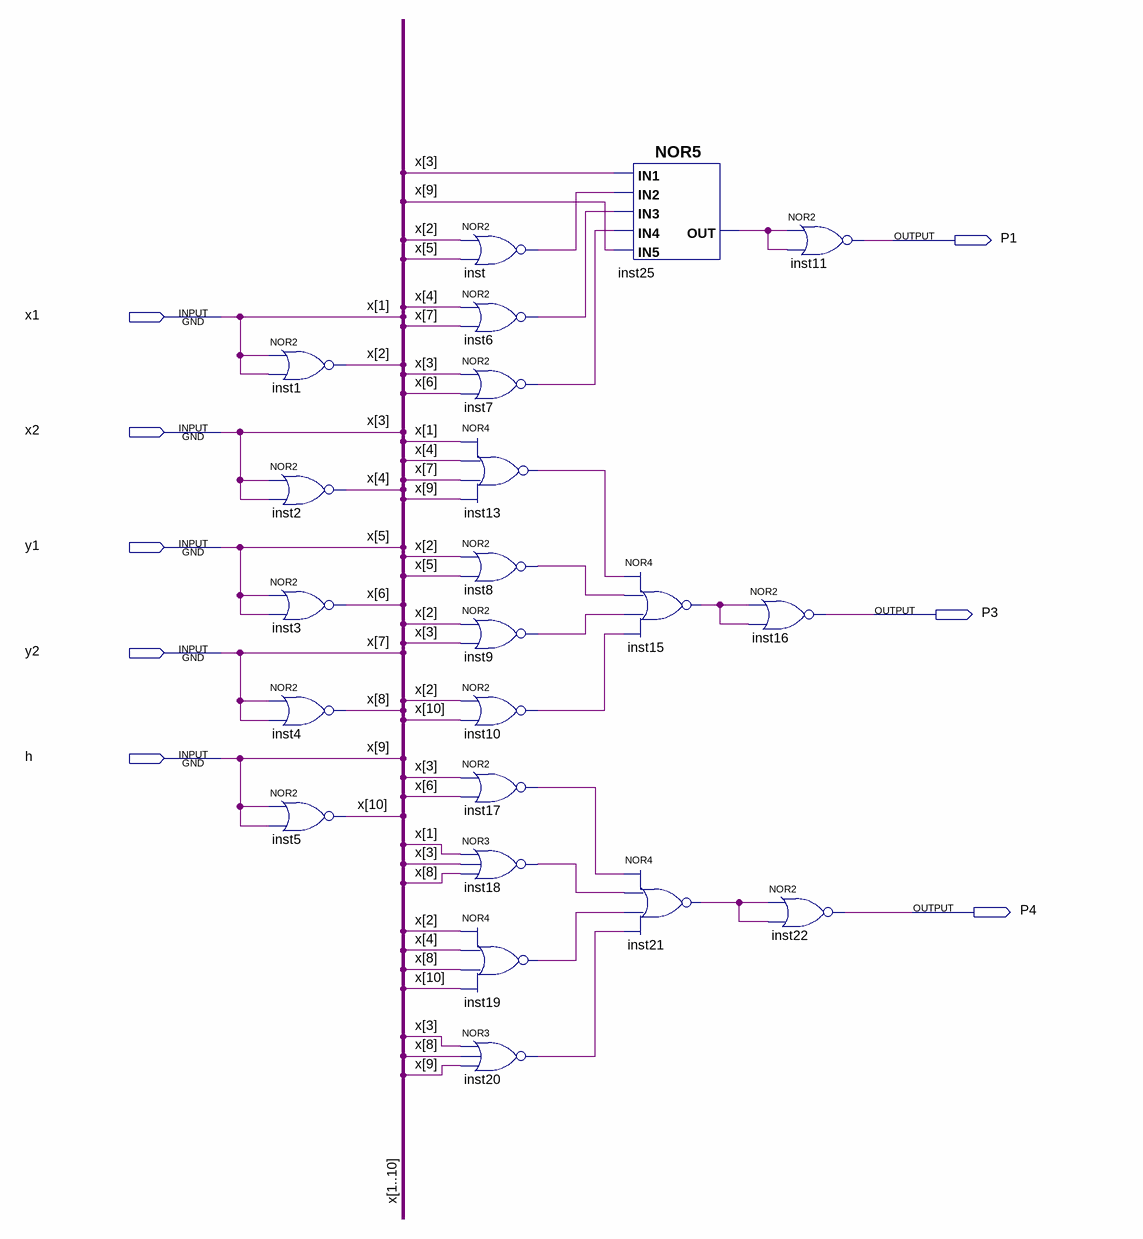
[diagram p0: schematic sheet]
// Quartus schematic OCHY.bdf as structural Verilog: 22 symbols, 8 pins
module OCHY (
  input  x1,
  input  x2,
  input  y1,
  input  y2,
  input  h,
  output P1,
  output P3,
  output P4
);

  wire inst6_out, inst7_out, inst8_out, inst9_out, inst10_out, inst13_out, inst15_out, inst17_out,
       inst18_out, inst19_out, inst20_out, inst21_out, inst25_out, inst_out;
  wire [10:4] x;

  nor inst1 (x2, x1, x1);
  nor inst2 (x[4], x2, x2);
  nor inst3 (x[6], y1, y1);
  nor inst4 (x[8], y2, y2);
  nor inst5 (x[10], h, h);
  nor inst (inst_out, x2, y1);
  nor inst6 (inst6_out, x[4], y2);
  nor inst7 (inst7_out, x2, x[6]);
  nor inst13 (inst13_out, x1, x[4], y2, h);
  nor inst8 (inst8_out, x2, y1);
  nor inst9 (inst9_out, x2, x2);
  nor inst10 (inst10_out, x2, x[10]);
  nor inst17 (inst17_out, x2, x[6]);
  nor inst18 (inst18_out, x1, x2, x[8]);
  nor inst19 (inst19_out, x2, x[4], x[8], x[10]);
  nor inst20 (inst20_out, x2, x[8], h);
  nor inst25 (inst25_out, x2, inst_out, inst6_out, inst7_out, h);
  nor inst15 (inst15_out, inst13_out, inst8_out, inst9_out, inst10_out);
  nor inst21 (inst21_out, inst17_out, inst18_out, inst19_out, inst20_out);
  nor inst11 (P1, inst25_out, inst25_out);
  nor inst16 (P3, inst15_out, inst15_out);
  nor inst22 (P4, inst21_out, inst21_out);

  // Other names for the same wires on the sheet: x (some bits) = {h, y2, y1, x2}
endmodule
